# Altium schematic sheet Management.SchDoc: SVPXFMC Carrier 3U
size A4; CheckedBy: \; Author: G.Kasprowicz; CompanyName: ISE; DrawnBy: T.Przywozki; Organization: WUT ISE; Address1: Warsaw University of Technology; Address2: Nowowiejska 15/19 00-665 Warsaw; Revision: 1.0.; SheetNumber: 16; SheetTotal: 20; Project: SVPXFMC Carrier 3U; ModifiedBy: -; CheckedDate: -; Title2: MSP430 management MCU; DivGrp: ISE; Designer: G. Kasprowicz
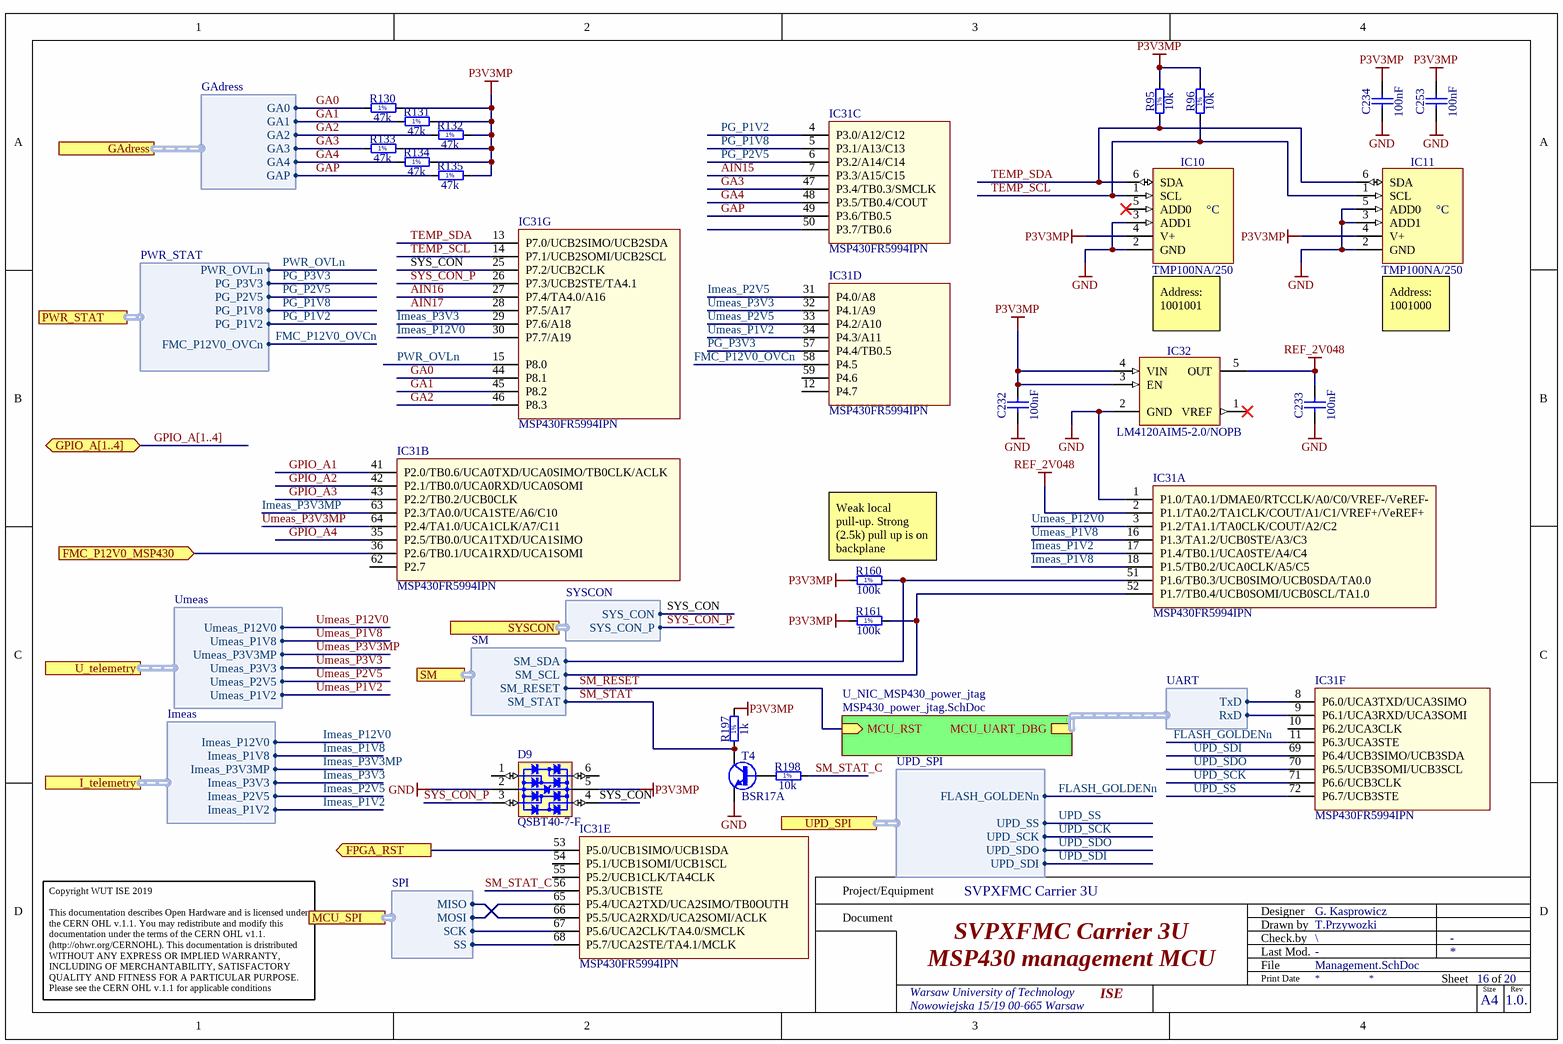
[diagram p0: Management.SchDoc]

## Parts
C232  100nF  [CAPC1005X55N]
C233  100nF  [CAPC1005X55N]
C234  100nF  [CAPC1005X55N]
C253  100nF  [CAPC1005X55N]
D9  QSBT40-7-F  [SOT65P210X110-6N]
IC10  TMP100NA/250  [SOT95P280X145-6N]
IC11  TMP100NA/250  [SOT95P280X145-6N]
IC31  MSP430FR5994IPN  [PQFP50P1400X1400-80N]  (parts A,B,C,D,E,F,G of 9)
IC32  LM4120AIM5-2.0/NOPB  [SOT95P280X145-5N]
R95  10k  [RESC1005X40N]
R96  10k  [RESC1005X40N]
R130  47k  [RESC1005X40N]
R131  47k  [RESC1005X40N]
R132  47k  [RESC1005X40N]
R133  47k  [RESC1005X40N]
R134  47k  [RESC1005X40N]
R135  47k  [RESC1005X40N]
R160  100k  [RESC1005X40N]
R161  100k  [RESC1005X40N]
R197  1k  [RESC1005X40N]
R198  10k  [RESC1005X40N]
T4  BSR17A  [SOT95P240X110-3N]

## Sub-sheets
U_NIC_MSP430_power_jtag = MSP430_power_jtag.SchDoc: MCU_UART_DBG (harness UART), MCU_RST (in)

## Ports
FMC_P12V0_MSP430 (in), FPGA_RST (out), GAdress (harness GAdress), GPIO_A[1..4] (bidir), I_telemetry (harness Imeas), MCU_SPI (harness SPI), PWR_STAT (harness PWR_STAT), SM (harness SM), SYSCON (harness SYSCON), U_telemetry (harness Umeas), UPD_SPI (harness UPD_SPI)

## Harnesses
SPI: MISO, MOSI, SCK, SS
UART: TxD, RxD
SM: SM_SCL, SM_SDA, SM_RESET, SM_STAT
GAdress: GA0, GA1, GA2, GA3, GA4, GAP
PWR_STAT: FMC_P12V0_OVCn, PG_P1V2, PG_P1V8, PG_P2V5, PG_P3V3, PWR_OVLn
SYSCON: SYS_CON, SYS_CON_P
UPD_SPI: UPD_SS, UPD_SCK, UPD_SDO, UPD_SDI, FLASH_GOLDENn
Imeas: Imeas_P12V0, Imeas_P1V8, Imeas_P3V3, Imeas_P2V5, Imeas_P1V2, Imeas_P3V3MP
Umeas: Umeas_P12V0, Umeas_P1V8, Umeas_P3V3, Umeas_P2V5, Umeas_P1V2, Umeas_P3V3MP

## Nets
GND: C232.1 C233.1 C234.1 C253.1 D9.2(GND) IC10.2(GND) IC10.3(ADD1) IC11.2(GND) IC11.3(ADD1) IC11.5(ADD0) IC31.1(P1.0/TA0.1/DMAE0/RTCCLK/A0/C0/VREF-/VeREF-) IC32.2(GND) T4.2(E)
P3V3MP: C232.2 C234.2 C253.2 D9.5(VBUS) IC10.4(V+) IC11.4(V+) IC32.3(EN) IC32.4(VIN) R95.2 R96.2 R130.2 R131.2 R132.2 R133.2 R134.2 R135.2 R160.1 R161.1 R197.2
REF_2V048: C233.2 IC31.2(P1.1/TA0.2/TA1CLK/COUT/A1/C1/VREF+/VeREF+) IC32.5(OUT)
AIN15: IC31.7(P3.3/A15/C15)
AIN16: IC31.27(P7.4/TA4.0/A16)
AIN17: IC31.28(P7.5/A17)
FLASH_GOLDENn: IC31.11(P6.3/UCA3STE) ; port UPD_SPI.FLASH_GOLDENn
FMC_P12V0_MSP430: IC31.36(P2.6/TB0.1/UCA1RXD/UCA1SOMI) ; port FMC_P12V0_MSP430
FMC_P12V0_OVCn: IC31.58(P4.5) ; port PWR_STAT.FMC_P12V0_OVCn
FPGA_RST: IC31.53(P5.0/UCB1SIMO/UCB1SDA) ; port FPGA_RST
GA0: IC31.44(P8.1) R130.1 ; port GAdress.GA0
GA1: IC31.45(P8.2) R131.1 ; port GAdress.GA1
GA2: IC31.46(P8.3) R132.1 ; port GAdress.GA2
GA3: IC31.47(P3.4/TB0.3/SMCLK) R133.1 ; port GAdress.GA3
GA4: IC31.48(P3.5/TB0.4/COUT) R134.1 ; port GAdress.GA4
GAP: IC31.49(P3.6/TB0.5) R135.1 ; port GAdress.GAP
GPIO_A1: IC31.41(P2.0/TB0.6/UCA0TXD/UCA0SIMO/TB0CLK/ACLK)
GPIO_A2: IC31.42(P2.1/TB0.0/UCA0RXD/UCA0SOMI)
GPIO_A3: IC31.43(P2.2/TB0.2/UCB0CLK)
GPIO_A4: IC31.35(P2.5/TB0.0/UCA1TXD/UCA1SIMO)
Imeas_P1V2: IC31.17(P1.4/TB0.1/UCA0STE/A4/C4) ; port I_telemetry.Imeas_P1V2
Imeas_P1V8: IC31.18(P1.5/TB0.2/UCA0CLK/A5/C5) ; port I_telemetry.Imeas_P1V8
Imeas_P2V5: IC31.31(P4.0/A8) ; port I_telemetry.Imeas_P2V5
Imeas_P3V3: IC31.29(P7.6/A18) ; port I_telemetry.Imeas_P3V3
Imeas_P3V3MP: IC31.63(P2.3/TA0.0/UCA1STE/A6/C10) ; port I_telemetry.Imeas_P3V3MP
Imeas_P12V0: IC31.30(P7.7/A19) ; port I_telemetry.Imeas_P12V0
PG_P1V2: IC31.4(P3.0/A12/C12) ; port PWR_STAT.PG_P1V2
PG_P1V8: IC31.5(P3.1/A13/C13) ; port PWR_STAT.PG_P1V8
PG_P2V5: IC31.6(P3.2/A14/C14) ; port PWR_STAT.PG_P2V5
PG_P3V3: IC31.57(P4.4/TB0.5) ; port PWR_STAT.PG_P3V3
PWR_OVLn: IC31.15(P8.0) ; port PWR_STAT.PWR_OVLn
SM_RESET: sheet U_NIC_MSP430_power_jtag/MCU_RST, port SM.SM_RESET
SM_STAT: R197.1 T4.3(C) ; port SM.SM_STAT
SM_STAT_C: IC31.56(P5.3/UCB1STE) R198.2
SYS_CON: D9.4(I/O3) IC31.25(P7.2/UCB2CLK) ; port SYSCON.SYS_CON
SYS_CON_P: D9.3(I/O2) IC31.26(P7.3/UCB2STE/TA4.1) ; port SYSCON.SYS_CON_P
TEMP_SCL: IC10.1(SCL) IC11.1(SCL) IC31.14(P7.1/UCB2SOMI/UCB2SCL) R96.1
TEMP_SDA: IC10.6(SDA) IC11.6(SDA) IC31.13(P7.0/UCB2SIMO/UCB2SDA) R95.1
Umeas_P1V2: IC31.34(P4.3/A11) ; port U_telemetry.Umeas_P1V2
Umeas_P1V8: IC31.16(P1.3/TA1.2/UCB0STE/A3/C3) ; port U_telemetry.Umeas_P1V8
Umeas_P2V5: IC31.33(P4.2/A10) ; port U_telemetry.Umeas_P2V5
Umeas_P3V3: IC31.32(P4.1/A9) ; port U_telemetry.Umeas_P3V3
Umeas_P3V3MP: IC31.64(P2.4/TA1.0/UCA1CLK/A7/C11) ; port U_telemetry.Umeas_P3V3MP
Umeas_P12V0: IC31.3(P1.2/TA1.1/TA0CLK/COUT/A2/C2) ; port U_telemetry.Umeas_P12V0
UPD_SCK: IC31.71(P6.6/UCB3CLK) ; port UPD_SPI.UPD_SCK
UPD_SDI: IC31.69(P6.4/UCB3SIMO/UCB3SDA) ; port UPD_SPI.UPD_SDI
UPD_SDO: IC31.70(P6.5/UCB3SOMI/UCB3SCL) ; port UPD_SPI.UPD_SDO
UPD_SS: IC31.72(P6.7/UCB3STE) ; port UPD_SPI.UPD_SS
NetIC31_8: IC31.8(P6.0/UCA3TXD/UCA3SIMO) ; sheet U_NIC_MSP430_power_jtag/MCU_UART_DBG.TxD
NetIC31_9: IC31.9(P6.1/UCA3RXD/UCA3SOMI) ; sheet U_NIC_MSP430_power_jtag/MCU_UART_DBG.RxD
NetIC31_51: IC31.51(P1.6/TB0.3/UCB0SIMO/UCB0SDA/TA0.0) R160.2 ; port SM.SM_SDA
NetIC31_52: IC31.52(P1.7/TB0.4/UCB0SOMI/UCB0SCL/TA1.0) R161.2 ; port SM.SM_SCL
NetIC31_65: IC31.65(P5.4/UCA2TXD/UCA2SIMO/TB0OUTH) ; port MCU_SPI.MOSI
NetIC31_66: IC31.66(P5.5/UCA2RXD/UCA2SOMI/ACLK) ; port MCU_SPI.MISO
NetIC31_67: IC31.67(P5.6/UCA2CLK/TA4.0/SMCLK) ; port MCU_SPI.SCK
NetIC31_68: IC31.68(P5.7/UCA2STE/TA4.1/MCLK) ; port MCU_SPI.SS
NetR198_1: R198.1 T4.1(B)

Not connected (* = marked no-connect by the designer): D9 1(I/O1) 6(I/O4); IC10 5(ADD0)*; IC31 10(P6.2/UCA3CLK) 12(P4.7) 50(P3.7/TB0.6) 54(P5.1/UCB1SOMI/UCB1SCL) 55(P5.2/UCB1CLK/TA4CLK) 59(P4.6) 62(P2.7); IC32 1(VREF)*

## Buses and harness runs
bus GPIO_A[1..4] = port GPIO_A[1..4]

## Notes on the sheet
- Address: 1001001
- (near IC11) Address: 1001000
- (near R160) Weak local pull-up. Strong (2.5k) pull up is on backplane
- Project/Equipment
- Document
- Designer
- Drawn by
- Check.by
- Copyright WUT ISE 2019
  This documentation describes Open Hardware and is licensed under the CERN OHL v.1.1. You may redistribute and modify this documentation under the terms of the CERN OHL v1.1.
  (http://ohwr.org/CERNOHL). This documentation is dristributed WITHOUT ANY EXPRESS OR IMPLIED WARRANTY, INCLUDING OF MERCHANTABILITY, SATISFACTORY QUALITY AND FITNESS FOR A PARTICULAR PURPOSE. Please see the CERN OHL v.1.1 for applicable conditions
- File
- Last Mod.
- Print Date
- Sheet
- Size
- A4
- of
- Rev
- (in symbol R0402_1K_1%_0.0625W_100PPM) 1%
- (in symbol R0402_10K_1%_0.0625W_100PPM) 1%
- (in symbol R0402_47K_1%_0.0625W_100PPM) 1%
- (in symbol R0402_100K_1%_0.0625W_100PPM) 1%
- (in symbol TMP100NA/250) °C

## Library data of the parts
C232-C234 C253 = CC0402_100NF_25V_10%_X7R_YUDEN_TMK105B7104KVHF: Non-polarised capacitor; Part Description: SMD Multilayer Chip Ceramic Capacitor (High Dielectric Type) for Automotive / Industrial Applications; Manufacturer: TAIYO YUDEN; Voltage: 25V; TC: X7R; Tolerance: ±10%; Part Number: CC0402_100NF_25V_10%_X7R_YUDEN_TMK105B7104KVHF; Component Kind: Standard; Component Type: Standard; Pin Count: 2; Value: 100nF; Status: Not Recommended; Manufacturer Part Number: TMK105B7104KVHF; Case: 0402; Mounted: Yes; Socket: No; SMD: Yes; Sense: No; HelpURL: \\cern.ch\dfs\Applications\Altium\Datasheets\CC0402_TAIYO-YUDEN_TMK105B7104KVHF.pdf; Author: CERN DEM JLC; ComponentHeight: 0.55mm
  C232 C233: CreateDate: 10.05.2017; LatestRevisionDate: 10.05.2017
  C234 C253: CreateDate: 10/05/2017; LatestRevisionDate: 10/05/2017
D9 = D_TVS_QSBT40-7-F: Bonding: No; PressFit: No; Case: *; Component Kind: Standard; Component Type: Standard; ComponentHeigth: *; CreateDate: 2018-01-01; Device: QSBT40-7-F; Footprint: SOT363; HelpURL: *; LatestRevisionDate: 2018-01-01; Manufacturer: *; Manufacturer Part Number: QSBT40-7-F; Mounted: Yes; PackageDescription: *; Part Description: *; Part Number: *; Pin Count: 6; Sense: No; SMD: Yes; Socket: No; Value: *
IC10 IC11 = TMP100NA/250: Digital Temperature Sensor with I2C Interface; Part Description: -55°C to +125°C, ±3.0°C Accuracy, Digital Temperature Sensor with I2C Interface; Manufacturer: TEXAS INSTRUMENTS; PressFit: No; Bonding: No; Part Number: TMP100NA/250; Component Kind: Standard; Component Type: Standard; Device: TMP100NA/250; PackageDescription: SOT23, 6-Leads, Body 1.6x3.0mm, Pitch 0.95mm, IPC Medium Density; Manufacturer Part Number: TMP100NA/250; Pin Count: 6; Case: SOT23-6; Mounted: Yes; Socket: No; SMD: Yes; Sense: No; ComponentHeight: 1.45mm; HelpURL: \\cern.ch\dfs\Applications\Altium\Datasheets\TMP100NA-250.pdf; Author: CERN DEM JLC; CreateDate: 29.10.2012; LatestRevisionDate: 29.10.2012
IC31 = MSP430FR5994IPN: Manufacturer: TI; Part Description: FRAM microcontroller; Bonding: No; ComponentHeigth: 2mm; PressFit: No; Case: LQFP80; Component Kind: Standard; Component Type: Standard; CreateDate: 2018-01-01; Device: MSP430FR5994IPN; Footprint: LQFP80; HelpURL: *; LatestRevisionDate: 2018-01-01; Manufacturer Part Number: MSP430FR5994IPN; Mounted: Yes; PackageDescription: LQFP80; Part Number: MSP430FR5994IPN; Pin Count: 80; Sense: No; SMD: Yes; Socket: No; Value: *
IC32 = LM4120AIM5-2.0/NOPB: Precision Micropower Low Dropout Voltage Reference; Part Description: 2.048V Precision Micropower Low Dropout Voltage Reference; Manufacturer: TEXAS INSTRUMENTS; PressFit: No; Bonding: No; Part Number: LM4120AIM5-2.0/NOPB; Component Kind: Standard; Component Type: Standard; Device: LM4120AIM5-2.0/NOPB; PackageDescription: SOT, 0.95mm Pitch; 5 Pin, 1.60mm W X 2.90mm L X 1.45mm H Body, IPC Medium Density; Manufacturer Part Number: LM4120AIM5-2.0/NOPB; Pin Count: 5; Case: SOT23-5; Mounted: Yes; Socket: No; SMD: Yes; Sense: No; ComponentHeight: 1.45mm; HelpURL: \\cern.ch\dfs\Applications\Altium\Datasheets\LM4120AIM5-2.0-NOPB.pdf; Author: CERN DEM JMW; CreateDate: 2016-08-31; LatestRevisionDate: 2016-08-31
R95 R96 R198 = R0402_10K_1%_0.0625W_100PPM: Resistor - 1%; Part Description: General Purpose Thick Film Chip Resistor; Manufacturer: GENERIC; Manufacturer1 Part Number: 232270671003L; TC: ±100ppm/°C; PressFit: No; Part Number: R0402_10K_1%_0.0625W_100PPM; Component Kind: Standard; Component Type: Standard; Pin Count: 2; Value: 10k; Status: Not Recommended; Power: 0.0625W; Tolerance: ±1%; Manufacturer Part Number: R0402_10K_1%_0.0625W_100PPM; Case: 0402; Mounted: Yes; Sense: No; Socket: No; SMD: Yes; Manufacturer1 Example: YAGEO PHYCOMP; Manufacturer1 ComponentHeight: 0.4mm; HelpURL: \\cern.ch\dfs\Applications\Altium\Datasheets\R0402_Phycomp_RC0402.pdf; Author: CERN DEM JLC
  R95 R96: CreateDate: 03.12.2007; LatestRevisionDate: 17.10.2012
  R198: CreateDate: 03/12/2007; LatestRevisionDate: 17/10/2012
R130-R135 = R0402_47K_1%_0.0625W_100PPM: Resistor - 1%; Part Description: General Purpose Thick Film Chip Resistor; Manufacturer: GENERIC; Manufacturer1 Part Number: 232270675103L; TC: ±100ppm/°C; PressFit: No; Part Number: R0402_47K_1%_0.0625W_100PPM; Component Kind: Standard; Component Type: Standard; Pin Count: 2; Value: 47k; Status: Not Recommended; Power: 0.0625W; Tolerance: ±1%; Manufacturer Part Number: R0402_47K_1%_0.0625W_100PPM; Case: 0402; Mounted: Yes; Sense: No; Socket: No; SMD: Yes; Manufacturer1 Example: YAGEO PHYCOMP; Manufacturer1 ComponentHeight: 0.4mm; HelpURL: \\cern.ch\dfs\Applications\Altium\Datasheets\R0402_Phycomp_RC0402.pdf; Author: CERN DEM JLC; CreateDate: 03.12.2007; LatestRevisionDate: 17.10.2012
R160 R161 = R0402_100K_1%_0.0625W_100PPM: Resistor - 1%; Part Description: General Purpose Thick Film Chip Resistor; Manufacturer: GENERIC; Manufacturer1 Part Number: 232270671004L; TC: ±100ppm/°C; PressFit: No; Part Number: R0402_100K_1%_0.0625W_100PPM; Component Kind: Standard; Component Type: Standard; Pin Count: 2; Value: 100k; Status: Not Recommended; Power: 0.0625W; Tolerance: ±1%; Manufacturer Part Number: R0402_100K_1%_0.0625W_100PPM; Case: 0402; Mounted: Yes; Sense: No; Socket: No; SMD: Yes; Manufacturer1 Example: YAGEO PHYCOMP; Manufacturer1 ComponentHeight: 0.4mm; HelpURL: \\cern.ch\dfs\Applications\Altium\Datasheets\R0402_Phycomp_RC0402.pdf; Author: CERN DEM JLC; CreateDate: 03.12.2007; LatestRevisionDate: 17.10.2012
R197 = R0402_1K_1%_0.0625W_100PPM: Resistor - 1%; Part Description: General Purpose Thick Film Chip Resistor; Manufacturer: GENERIC; Manufacturer1 Part Number: 232270671002L; TC: ±100ppm/°C; PressFit: No; Part Number: R0402_1K_1%_0.0625W_100PPM; Component Kind: Standard; Component Type: Standard; Pin Count: 2; Value: 1k; Status: Not Recommended; Power: 0.0625W; Tolerance: ±1%; Manufacturer Part Number: R0402_1K_1%_0.0625W_100PPM; Case: 0402; Mounted: Yes; Sense: No; Socket: No; SMD: Yes; Manufacturer1 Example: YAGEO PHYCOMP; Manufacturer1 ComponentHeight: 0.4mm; HelpURL: \\cern.ch\dfs\Applications\Altium\Datasheets\R0402_Phycomp_RC0402.pdf; Author: CERN DEM JLC; CreateDate: 03.12.2007; LatestRevisionDate: 17.10.2012
T4 = BSR17A: NPN Transistor; Part Description: 40V 200mA NPN General-Purpose Amplifier; Manufacturer: FAIRCHILD SEMICONDUCTOR; PressFit: No; Bonding: No; Part Number: BSR17A; Component Kind: Standard; Component Type: Standard; Device: BSR17A; PackageDescription: SOT23 3-Leads, Pitch 0.95mm - Body 1.4x3mm, IPC Medium Density; Manufacturer Part Number: BSR17A; Pin Count: 3; Case: SOT23-3; Mounted: Yes; Socket: No; SMD: Yes; Sense: No; ComponentHeight: 1.3mm; HelpURL: \\cern.ch\dfs\Applications\Altium\Datasheets\BSR17A.pdf; Author: CERN DEM JLC; CreateDate: 14.05.2008; LatestRevisionDate: 14.05.2008